# Altium schematic sheet Slip_Ring.SchDoc
size Letter
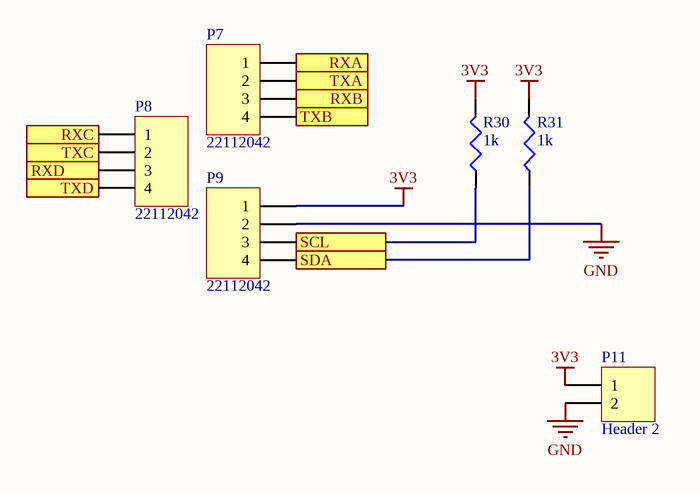
[diagram p0: Slip_Ring.SchDoc]

## Parts
P7  Manufacturer Part Number: 22112042  [MOLX-22112042]  (hidden comment: Header 4)
P8  Manufacturer Part Number: 22112042  [MOLX-22112042]  (hidden comment: Header 4)
P9  Manufacturer Part Number: 22112042  [MOLX-22112042]  (hidden comment: Header 4)
P11  Header 2  [MOLX-0010845020]
R30  value 1k  [PANA-ERJ3EK]  (hidden comment: Res3)
R31  value 1k  [PANA-ERJ3EK]  (hidden comment: Res3)

## Ports
RXA, RXB, RXC, RXD, SCL, SDA, TXA, TXB, TXC, TXD

## Nets
3V3: P9.1 P11.1 R30.2 R31.2
GND: P9.2 P11.2
RXA: P7.1 ; port RXA
RXB: P7.3 ; port RXB
RXC: P8.1 ; port RXC
RXD: P8.3 ; port RXD
SCL: P9.3 R30.1 ; port SCL
SDA: P9.4 R31.1 ; port SDA
TXA: P7.2 ; port TXA
TXB: P7.4 ; port TXB
TXC: P8.2 ; port TXC
TXD: P8.4 ; port TXD

## Notes on the sheet
- Title
- Size:
- Date:
- Letter
- Number:
- Time:
- Revision:
- Sheet
- of
- File:

## Library data of the parts
P7-P9 = 34: CONN HEADER 4POS .100 VERT GOLD; Part Number: 34; Designator: P?; LatestRevisionDate: 17-Jul-2002; LatestRevisionNote: Re-released for DXP Platform.; Publisher: Altium Limited; Supplier Part Number 1: WM2702-ND; Supplier 1: Digi-Key; Supplier Link: http://www.digikey.ca/product-search/en?keywords=WM2702-ND; PackageReference: MOLX-22112042
P11 = 41: CONN HEADER PIN 94V-0 2POS; Part Number: 41; Manufacturer Part Number: 0010845020; Designator: P?; LatestRevisionDate: 17-Jul-2002; LatestRevisionNote: Re-released for DXP Platform.; Publisher: Altium Limited; Supplier Part Number 1: WM13100-ND; Supplier 1: Digi-Key; Supplier Link: #https://www.digikey.com/product-detail/en/molex-llc/0010845020/WM13100-ND/3068040#; PackageReference: MOLX-0010845020
R30 R31 = 15398: RES SMD 1K OHM 1% 1/10W 0603; Part Number: 15398; Manufacturer Part Number: ERJ-3EKF1001V; Designator: R?; Power: 0.1W, 1/10W; Temperature Coefficient: ±100ppm/°C; Published: 8-Jun-2000; LatestRevisionDate: 29-May-2009; LatestRevisionNote: IPC-7351 Footprint Added.; PackageReference: 0603 (1608 Metric); Publisher: Altium Limited; PackageDescription: Chip Resistor, 2-Leads, Body 1.60x0.80mm, IPC Low Density; Supplier Part Number 1: P1.00KHCT-ND; Supplier 1: Digi-Key; Supplier Link: http://www.digikey.ca/product-search/en?keywords=P1.00KHCT-ND; Tolerance: ±1%